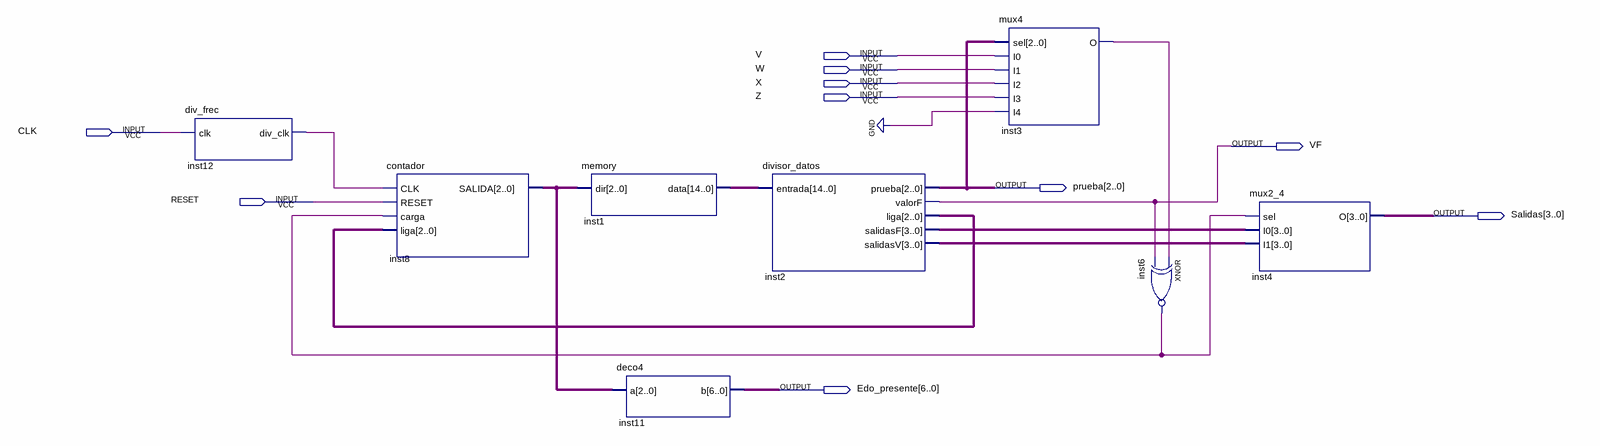
[diagram p0: schematic sheet]
// Quartus schematic practica5_fpga.bdf as structural Verilog: 8 symbols, 10 pins
module practica5_fpga (
  input  V,
  input  W,
  input  X,
  input  Z,
  input  CLK,
  input  RESET,
  output VF,
  output [2:0] prueba,
  output [3:0] Salidas,
  output [6:0] Edo_presente
);

  wire inst3_o, inst6_out, inst12_div_clk;
  wire [2:0] inst2_liga, inst8_salida;
  wire [3:0] inst2_salidasf, inst2_salidasv;
  wire [14:0] inst1_data;

  div_frec inst12 (.clk(CLK), .div_clk(inst12_div_clk));
  contador inst8 (.CLK(inst12_div_clk), .RESET(RESET), .carga(inst6_out), .liga(inst2_liga), .SALIDA(inst8_salida));
  memory inst1 (.dir(inst8_salida), .data(inst1_data));
  deco4 inst11 (.a(inst8_salida), .b(Edo_presente));
  divisor_datos inst2 (
    .entrada(inst1_data), .prueba(prueba), .valorF(VF), .liga(inst2_liga), .salidasF(inst2_salidasf),
    .salidasV(inst2_salidasv));
  mux4 inst3 (.sel(prueba), .I0(V), .I1(W), .I2(X), .I3(Z), .I4(1'b0), .O(inst3_o));
  xnor inst6 (inst6_out, inst3_o, VF);
  mux2_4 inst4 (.sel(inst6_out), .I0(inst2_salidasf), .I1(inst2_salidasv), .O(Salidas));
endmodule
